# EAGLE schematic Standing Desk Controller Schematic v7 v9 (EAGLE 9.7.0)
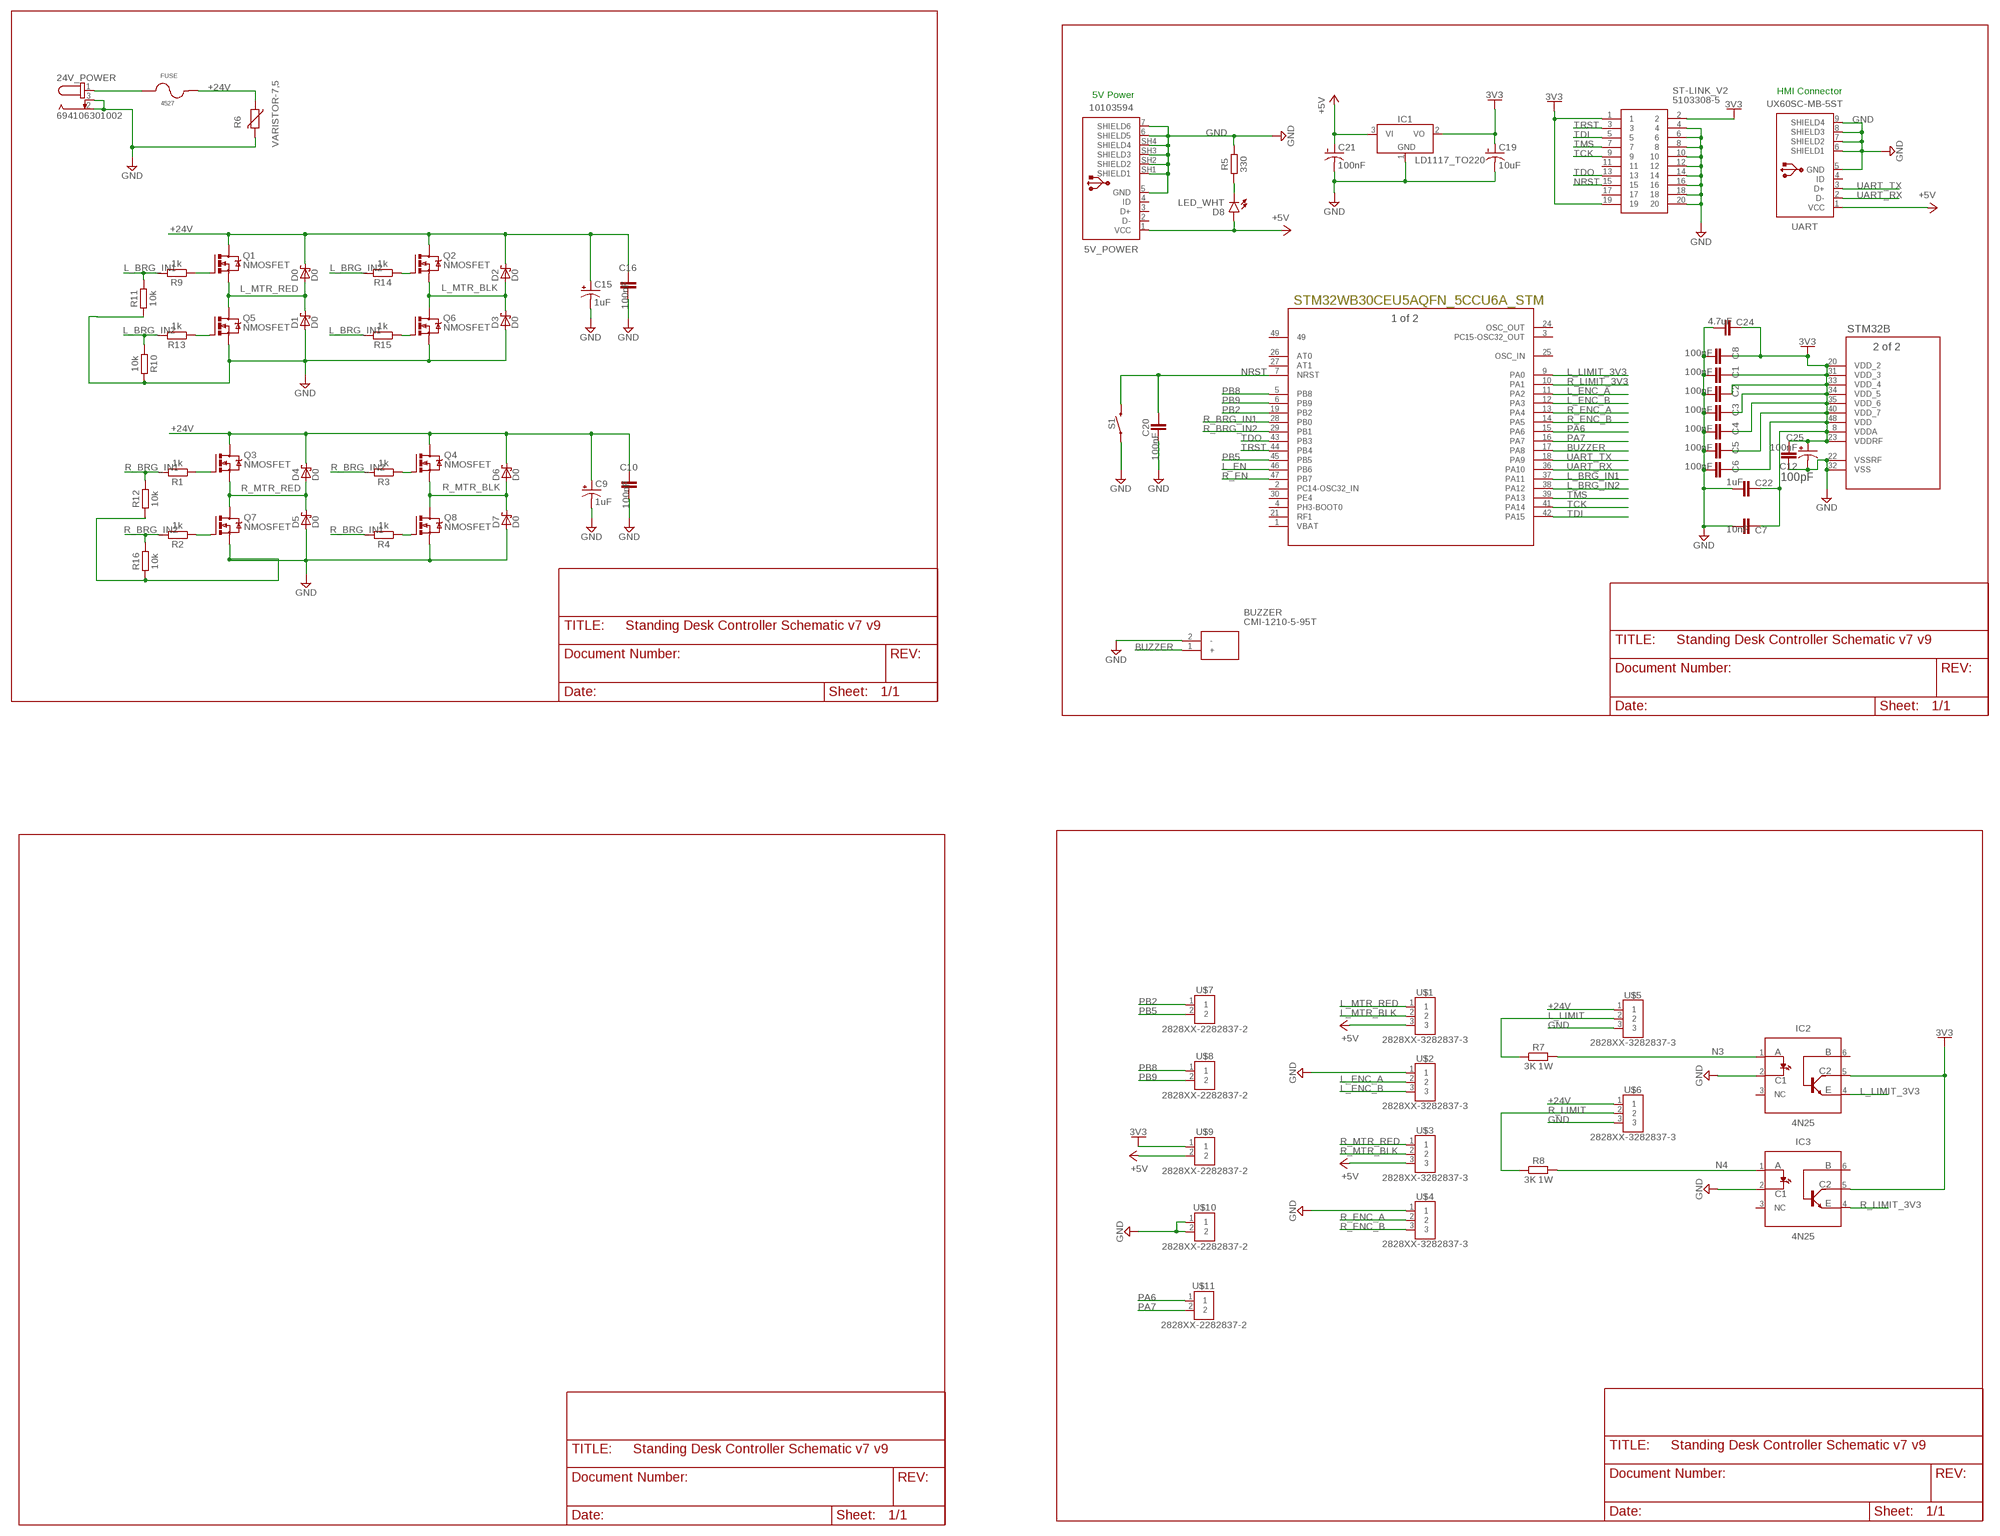
[diagram p0: schematic, sheet 1]

## Parts
5V_POWER  10103594  [10103594]
24V_POWER  694106301002  [694106301002]
BUZZER  CMI-1210-5-95T  [CMI1210595T]
C1  100nF  C_CHIP-1206(3216-METRIC)  [CAPC3216X135]
C2  100nF  C_CHIP-1206(3216-METRIC)  [CAPC3216X135]
C3  100nF  C_CHIP-1206(3216-METRIC)  [CAPC3216X135]
C4  100nF  C_CHIP-1206(3216-METRIC)  [CAPC3216X135]
C5  100nF  C_CHIP-1206(3216-METRIC)  [CAPC3216X135]
C6  100nF  C_CHIP-1206(3216-METRIC)  [CAPC3216X135]
C7  10nF  C_RADIAL-12.5MM-DIA  [CAPRD550W60D1025H1250B]
C8  100nF  C_CHIP-1206(3216-METRIC)  [CAPC3216X135]
C9  1uF  CPOL-USE2.5-6  [E2,5-6]
C10  100nF  C_CHIP-1206(3216-METRIC)  [CAPC3216X135]
C12  100nF  C_CHIP-1206(3216-METRIC)  [CAPC3216X135]
C15  1uF  CPOL-USE2.5-6  [E2,5-6]
C16  100nF  C_CHIP-1206(3216-METRIC)  [CAPC3216X135]
C19  10uF  CPOL-USE2.5-6  [E2,5-6]
C20  100nF  C_CHIP-1206(3216-METRIC)  [CAPC3216X135]
C21  100nF  CPOL-USE2.5-6  [E2,5-6]
C22  1uF  C_RADIAL-12.5MM-DIA  [CAPRD550W60D1025H1250B]
C24  4.7uF  C_RADIAL-12.5MM-DIA  [CAPRD550W60D1025H1250B]
C25  100pF  CPOL-USE2.5-6  [E2,5-6]
D0  D0  SS14CT-ND  [SOD106A-W]
D1  D0  SS14CT-ND  [SOD106A-W]
D2  D0  SS14CT-ND  [SOD106A-W]
D3  D0  SS14CT-ND  [SOD106A-W]
D4  D0  SS14CT-ND  [SOD106A-W]
D5  D0  SS14CT-ND  [SOD106A-W]
D6  D0  SS14CT-ND  [SOD106A-W]
D7  D0  SS14CT-ND  [SOD106A-W]
D8  LED_WHT  CHIP-FLAT-B_1206  [LEDC3216X75N_FLAT-B]
FUSE  4527  [4527]
IC1  LD1117_TO220  [TO220V]
IC2  4N25  [DIP762W60P254L712H480Q6B]
IC3  4N25  [DIP762W60P254L712H480Q6B]
Q1  NMOSFET  NMOSFET_TO220  [TO220BV]
Q2  NMOSFET  NMOSFET_TO220  [TO220BV]
Q3  NMOSFET  NMOSFET_TO220  [TO220BV]
Q4  NMOSFET  NMOSFET_TO220  [TO220BV]
Q5  NMOSFET  NMOSFET_TO220  [TO220BV]
Q6  NMOSFET  NMOSFET_TO220  [TO220BV]
Q7  NMOSFET  NMOSFET_TO220  [TO220BV]
Q8  NMOSFET  NMOSFET_TO220  [TO220BV]
R1  1k  R_CHIP-1206(3216-METRIC)  [RESC3216X70]
R2  1k  R_CHIP-1206(3216-METRIC)  [RESC3216X70]
R3  1k  R_CHIP-1206(3216-METRIC)  [RESC3216X70]
R4  1k  R_CHIP-1206(3216-METRIC)  [RESC3216X70]
R5  330  R_CHIP-1206(3216-METRIC)  [RESC3216X70]
R6  VARISTOR-7,5  [R-7,5]
R7  3K 1W  R_AXIAL-7.2MM-PITCH  [RESAD724W46L381D178B]
R8  3K 1W  R_AXIAL-7.2MM-PITCH  [RESAD724W46L381D178B]
R9  1k  R_CHIP-1206(3216-METRIC)  [RESC3216X70]
R10  10k  R_CHIP-1206(3216-METRIC)  [RESC3216X70]
R11  10k  R_CHIP-1206(3216-METRIC)  [RESC3216X70]
R12  10k  R_CHIP-1206(3216-METRIC)  [RESC3216X70]
R13  1k  R_CHIP-1206(3216-METRIC)  [RESC3216X70]
R14  1k  R_CHIP-1206(3216-METRIC)  [RESC3216X70]
R15  1k  R_CHIP-1206(3216-METRIC)  [RESC3216X70]
R16  10k  R_CHIP-1206(3216-METRIC)  [RESC3216X70]
S1  MOMENTARY-SWITCH-SPST-PTH-6.0MM  [TACTILE_SWITCH_PTH_6.0MM]
ST-LINK_V2  5103308-5  [SHDR20W66P254_2X10_3289X914X98]
STM32  STM32WB30CEU5AQFN_5CCU6A_STM  [QFN_5CCU6A_STM]
U$1  2828XX-3282837-3  [TERMBLK_508-3N]
U$2  2828XX-3282837-3  [TERMBLK_508-3N]
U$3  2828XX-3282837-3  [TERMBLK_508-3N]
U$4  2828XX-3282837-3  [TERMBLK_508-3N]
U$5  2828XX-3282837-3  [TERMBLK_508-3N]
U$6  2828XX-3282837-3  [TERMBLK_508-3N]
U$7  2828XX-2282837-2  [TERMBLK_508-2N]
U$8  2828XX-2282837-2  [TERMBLK_508-2N]
U$9  2828XX-2282837-2  [TERMBLK_508-2N]
U$10  2828XX-2282837-2  [TERMBLK_508-2N]
U$11  2828XX-2282837-2  [TERMBLK_508-2N]
UART  UX60SC-MB-5ST  [UX60SC-MB-5ST]

## Nets
3V3: C1.1 C2.1 C3.1 C4.1 C5.1 C6.1 C7.1 C8.1 C12.1 C19.+ C22.1 C24.1 C25.+ IC1.2(VO) IC2.5(C2) IC3.5(C2) ST-LINK_V2.1 ST-LINK_V2.2 ST-LINK_V2.19 STM32.8(B:VDDA) STM32.20(B:VDD_2) STM32.23(B:VDDRF) STM32.31(B:VDD_3) STM32.33(B:VDD_4) STM32.34(B:VDD_5) STM32.35(B:VDD_6) STM32.40(B:VDD_7) STM32.48(B:VDD) U$9.1
+5V: 5V_POWER.1(VCC) C21.+ D8.A IC1.3(VI) U$1.3 U$3.3 U$9.2 UART.1(VCC)
+24V: C9.+ C10.1 C15.+ C16.1 D0.C D2.C D4.C D6.C FUSE.2 Q1.D Q2.D Q3.D Q4.D R6.1 U$5.1 U$6.1
BUZZER: BUZZER.1(+) STM32.17(A:PA8)
GND: 5V_POWER.5(GND) 5V_POWER.6(SHIELD5) 5V_POWER.7(SHIELD6) 5V_POWER.SH1(SHIELD1) 5V_POWER.SH2(SHIELD2) 5V_POWER.SH3(SHIELD3) 5V_POWER.SH4(SHIELD4) 24V_POWER.2 24V_POWER.3 BUZZER.2(-) C1.2 C2.2 C3.2 C4.2 C5.2 C6.2 C7.2 C8.2 C9.- C10.2 C12.2 C15.- C16.2 C19.- C20.2 C21.- C22.2 C24.2 C25.- D1.A D3.A D5.A D7.A IC1.1(GND) IC2.2(C1) IC3.2(C1) Q5.S Q6.S Q7.S Q8.S R5.2 R6.2 R10.2 R11.1 R12.1 R16.1 S1.1 ST-LINK_V2.4 ST-LINK_V2.6 ST-LINK_V2.8 ST-LINK_V2.10 ST-LINK_V2.12 ST-LINK_V2.14 ST-LINK_V2.16 ST-LINK_V2.18 ST-LINK_V2.20 STM32.22(B:VSSRF) STM32.32(B:VSS) U$2.1 U$4.1 U$5.3 U$6.3 U$10.1 U$10.2 UART.5(GND) UART.6(SHIELD1) UART.7(SHIELD2) UART.8(SHIELD3) UART.9(SHIELD4)
L_BRG_IN1: R9.2 R11.2 R15.2 STM32.37(A:PA11)
L_BRG_IN2: R10.1 R13.2 R14.2 STM32.38(A:PA12)
L_EN: STM32.46(A:PB6)
L_ENC_A: STM32.11(A:PA2) U$2.2
L_ENC_B: STM32.12(A:PA3) U$2.3
L_LIMIT: R7.1 U$5.2
L_LIMIT_3V3: IC2.4(E) STM32.9(A:PA0)
L_MTR_BLK: D2.A D3.C Q2.S Q6.D U$1.2
L_MTR_RED: D0.A D1.C Q1.S Q5.D U$1.1
N3: IC2.1(A) R7.2
N4: IC3.1(A) R8.2
N$1: 24V_POWER.1 FUSE.1
N$2: D8.C R5.1
N$3: Q1.G R9.1
N$4: Q5.G R13.1
N$5: Q3.G R1.1
N$6: Q2.G R14.1
N$7: Q6.G R15.1
N$8: Q7.G R2.1
N$9: Q4.G R3.1
N$10: Q8.G R4.1
NRST: C20.1 S1.3 ST-LINK_V2.15 STM32.7(A:NRST)
PA6: STM32.15(A:PA6) U$11.1
PA7: STM32.16(A:PA7) U$11.2
PB2: STM32.19(A:PB2) U$7.1
PB5: STM32.45(A:PB5) U$7.2
PB8: STM32.5(A:PB8) U$8.1
PB9: STM32.6(A:PB9) U$8.2
R_BRG_IN1: R1.2 R4.2 R12.2 STM32.28(A:PB0)
R_BRG_IN2: R2.2 R3.2 R16.2 STM32.29(A:PB1)
R_EN: STM32.47(A:PB7)
R_ENC_A: STM32.13(A:PA4) U$4.2
R_ENC_B: STM32.14(A:PA5) U$4.3
R_LIMIT: R8.1 U$6.2
R_LIMIT_3V3: IC3.4(E) STM32.10(A:PA1)
R_MTR_BLK: D6.A D7.C Q4.S Q8.D U$3.2
R_MTR_RED: D4.A D5.C Q3.S Q7.D U$3.1
TCK: ST-LINK_V2.9 STM32.41(A:PA14)
TDI: ST-LINK_V2.5 STM32.42(A:PA15)
TDO: ST-LINK_V2.13 STM32.43(A:PB3)
TMS: ST-LINK_V2.7 STM32.39(A:PA13)
TRST: ST-LINK_V2.3 STM32.44(A:PB4)
UART_RX: STM32.36(A:PA10) UART.2(D-)
UART_TX: STM32.18(A:PA9) UART.3(D+)
Unconnected: 5V_POWER.2(D-) 5V_POWER.3(D+) 5V_POWER.4(ID) IC2.3(NC) IC2.6(B) IC3.3(NC) IC3.6(B) ST-LINK_V2.11 ST-LINK_V2.17 STM32.1(A:VBAT) STM32.2(A:PC14-OSC32_IN) STM32.3(A:PC15-OSC32_OUT) STM32.4(A:PH3-BOOT0) STM32.21(A:RF1) STM32.24(A:OSC_OUT) STM32.25(A:OSC_IN) STM32.26(A:AT0) STM32.27(A:AT1) STM32.30(A:PE4) STM32.49 UART.4(ID)

## Notes on the sheet
- HMI Connector
- 5V Power

## Library data of the parts
5V_POWER = Connector_USB:10103594: USB(2.0) Micro-B, RCPT, 5POS, SMD-THT-R/A Datasheet <https://cdn.amphenol-icc.com/media/wysiwyg/files/documentation/datasheet/inputoutput/io_usb_micro.pdf> Drawing <https://cdn.amphenol-icc.com/media/wysiwyg/files/drawing/10103594.pdf>; CATEGORY: Connectors; CONTACTS: 5; CURRENT-RATING: 1.8A; DESCRIPTION: CONN RCPT USB2.0 MICRO B SMD R/A; GENDER: Receptacle; MANUFACTURER: Amphenol ICC (FCI); MOUNT_TYPE: R/A; MPN: 10103594-0001LF; OPERATING_TEMPERATURE: -30°C ~ 80°C; PART_STATUS: ACTIVE; ROHS_COMPLIANT: COMPLIANT; SUB_CATEGORY: USB; TYPE: USB-micro B; VOLTAGE-RATING: 100VAC
24V_POWER = DC Power Jacks:694106301002: CONN PWR JACK 2.1X5.5MM SOLDER Manufacturer's datasheet <https://katalog.we-online.de/em/datasheet/6941xx301002.pdf>; CREATED_BY: PCBLayout.com; DIGIKEY_PART_NUMBER: 732-5930-ND; MANUFACTURER: Wurth Electronics Inc.; MPN: 694106301002
BUZZER = CMI-1210-5-95T:CMI-1210-5-95T: Piezo Buzzers & Audio Indicators 12 mm, 5 Vdc, 98 dB, Through Hole, Magnetic Audio Indicator Buzzer Source: Datasheet <https://www.cuidevices.com/product/resource/cmi-1210-5-95t.pdf>; DESCRIPTION: Piezo Buzzers & Audio Indicators 12 mm, 5 Vdc, 98 dB, Through Hole, Magnetic Audio Indicator Buzzer; HEIGHT: 10mm; MANUFACTURER_NAME: CUI Inc.; MANUFACTURER_PART_NUMBER: CMI-1210-5-95T; MOUSER_PART_NUMBER: 179-CMI-1210-5-95T; MOUSER_PRICE-STOCK: https://www.mouser.co.uk/ProductDetail/CUI-Devices/CMI-1210-5-95T?qs=Rp5uXu7WBW9WJf9tZv97Vg%3D%3D
C1-C6 C8 C12 = Capacitor_Bottom_Side:C: Capacitor - Generic; CATEGORY: Capacitor
C7 C10 C16 C20 C22 C24 = Capacitor:C: Capacitor - Generic; CATEGORY: Capacitor
C9 C15 C19 C21 C25 = rcl:CPOL-US: POLARIZED CAPACITOR, American symbol; SPICEPREFIX: C
D0 D1-D7 = L298_Motor_Driver_Lib_ECE5780:SS14CT-ND: Schottky Diode: SS14CT-ND, 40V, 1A, DO-214AC, SMA
D8 = LED:CHIP-FLAT-B; CATEGORY: LED; COLOR: BLUE; DESCRIPTION: CHIP LED FLAT; SUB-CATEGORY: CHIP; TYPE: FLAT_TOP; VALUE: LED_BLUE
FUSE = Fuse Holder:4527: FUSE HLDR CARTRIDGE 250V 5A PCB Manufacturer's datasheet <https://www.keyelco.com/userAssets/file/M65p44.pdf>; CREATED_BY: PCBLayout.com; DIGIKEY_PN: 36-4527-ND; MANUFACTURER: Keystone Electronics; MPN: 4527
IC1 = IC_Power-Management:LD1117: Adjustable and fixed positive voltage regulator Reference Datasheet <https://www.st.com/content/ccc/resource/technical/document/datasheet/99/3b/7d/91/91/51/4b/be/CD00000544.pdf/files/CD00000544.pdf/jcr:content/translations/en.CD00000544.pdf>; CATEGORY: IC_Linear; DESCRIPTION: Adjustable voltage regulator; MANUFACTURER: STMicroelectronics; MPN: Generic; SERIES: LM1117; SUB-CATEGORY: Voltage Regulator; TYPE: Linear
IC2 IC3 = Opto-Electronic:4N: Optocoupler, Phototransistor Output, with Base Connection Datasheet <https://www.vishay.com/docs/83725/4n25.pdf>; CATEGORY: Opto-Electronic; DESCRIPTION: Optoisolator Transistor with Base Output 5000Vrms Channel 6-DIP; MANUFACTURER: Vishay; MPN: 4N25; OPERATING_TEMP: - 55°C to + 100 °C; PART_STATUS: Active; ROHS_COMPLIANT: COMPLIANT; SERIES: 4N2x; SUB-CATEGORY: Optocoupler; THERMALLOSS: 0.150 W
Q1-Q8 = Transistor:NMOSFET: N-Channel MOSFET - Generic; CATEGORY: Transistor; SUB-CATEGORY: MOSFET; TYPE: N-Channel
R1-R5 R7-R16 = Resistor:R: Resistor Fixed - Generic; CATEGORY: Resistor; SUB-CATEGORY: Fixed
R6 = varistor:VARISTOR: VARISTOR
S1 = SparkFun-Switches:MOMENTARY-SWITCH-SPST: Momentary Switch (Pushbutton) - SPST Normally-open (NO) SPST momentary switches (buttons, pushbuttons). Variants PTH-12MM - 12mm square, through-hole Momentary Pushbutton Switch - 12mm Square <https://www.sparkfun.com/products/9190> (COM-09190) PTH-6.0MM, PTH-6.0MM-KIT - 6.0mm square, through-hole Mini Pushbutton Switch <https://www.sparkfun.com/products/97> (COM-00097) KIT package intended for soldering kit's - only one side of pads' copper is exposed. PTH-RIGHT-ANGLE-KIT - Right-angle, through-hole Right Angle Tactile Button <https://www.sparkfun.com/products/10791> - Used on SparkFun BigTime Watch Kit <https://www.sparkfun.com/products/11734> SMD-12MM - 12mm square, surface-mount Tactile Button - SMD (12mm) <https://www.sparkfun.com/products/12993> (COM-12993) Used on SparkFun PicoBoard <https://www.sparkfun.com/products/11888> SMD-4.5MM - 4.5mm Square Trackball Switch Used on SparkFun Blackberry Trackballer Breakout <https://www.sparkfun.com/products/13169> SMD-4.6MMX2.8MM - 4.60mm x 2.80mm, surface mount Used on SparkFun SAMD21 Mini Breakout <https://www.sparkfun.com/products/13664> SMD-5.2MM, SMD-5.2-REDUNDANT - 5.2mm square, surface-mount Mini Pushbutton Switch - SMD <https://www.sparkfun.com/products/8720> (COM-08720) Used on Arduino Pro Mini <https://www.sparkfun.com/products/11114> REDUNDANT package connects both switch circuits together SMD-6.0X3.5MM - 6.0 x 3.5mm, surface mount Momentary Reset Switch SMD <https://www.sparkfun.com/products/8229> (COM-08229) SMD-6.2MM-TALL - 6.2mm square, surface mount Tactile Button - SMD (6mm) <https://www.sparkfun.com/products/12992> Used on SparkFun Digital Sandbox <https://www.sparkfun.com/products/12651> SMD-RIGHT-ANGLE - Right-angle, surface mount Used on SparkFun Block for Intel® Edison - Arduino <https://www.sparkfun.com/products/13036>; PROD_ID: SWCH-08441; SF_SKU: COM-00097
ST-LINK_V2 = 5103308-5:5103308-5: 20 Way HE10 Str PCB Header Plug TE Connectivity AMP-LATCH Series, 2.54mm Pitch 20 Way 2 Row Shrouded Straight PCB Header, Through Hole Source: Datasheet <https://componentsearchengine.com/Datasheets/1/5103308-5.pdf>; DESCRIPTION: 20 Way HE10 Str PCB Header Plug TE Connectivity AMP-LATCH Series, 2.54mm Pitch 20 Way 2 Row Shrouded Straight PCB Header, Through Hole; HEIGHT: 9.855mm; MANUFACTURER_NAME: TE Connectivity; MANUFACTURER_PART_NUMBER: 5103308-5; MOUSER_PART_NUMBER: 571-5103308-5; MOUSER_PRICE-STOCK: https://www.mouser.co.uk/ProductDetail/TE-Connectivity/5103308-5?qs=84A%2FDAdkstIALbbUeUfP1g%3D%3D
STM32 = STM32WB30CE_Fixed:STM32WB30CEU5A; COPYRIGHT: Copyright (C) 2022 Ultra Librarian. All rights reserved.; MANUFACTURER_PART_NUMBER: STM32WB30CEU5A; MFR_NAME: STMicroelectronics
U$1-U$6 = Connector:2828XX-3: 3 Position Wire to Board Terminal Block Horizontal with Board Datasheet <https://www.te.com.cn/commerce/DocumentDelivery/DDEController?Action=showdoc&DocId=Catalog+Section%7F1308389_EUROSTYLE_TERMINAL_BLOCKS%7F0607%7Fpdf%7FEnglish%7FENG_CS_1308389_EUROSTYLE_TERMINAL_BLOCKS_0607.pdf%7F2-282837-5>; CATEGORY: Connector; DESCRIPTION: TERM BLK 3P SIDE ENT 5.08mm PCB; MANUFACTURER: TE Connectivity; MPN: 282837-3; OPERATING_TEMPERATURE: -40°C to +105°C; PART_STATUS: Active; ROHS_COMPLIANCE: RoHS Compliant; SERIES: 282837; SUBCATEGORY: Terminal Block; TYPE: Side Wire Entry
U$7-U$11 = Connector:2828XX-2: 2 Position Wire to Board Terminal Block Horizontal with Board Datasheet <https://www.te.com.cn/commerce/DocumentDelivery/DDEController?Action=showdoc&DocId=Catalog+Section%7F1308389_EUROSTYLE_TERMINAL_BLOCKS%7F0607%7Fpdf%7FEnglish%7FENG_CS_1308389_EUROSTYLE_TERMINAL_BLOCKS_0607.pdf%7F2-282837-5>; CATEGORY: Connector; DESCRIPTION: 2 Position Wire to Board Terminal Block Horizontal with Board 5.08 mm Through Hole; MANUFACTURER: TE Connectivity; MPN: 282837-2; OPERATING_TEMPERATURE: -40°C to +105°C; PART_STATUS: ACTIVE; ROHS_COMPLIANCE: RoHS Compliant; SERIES: 282837; SUBCATEGORY: Terminal Block; TYPE: Side Wire Entry
UART = Connector_USB:UX60SC-MB-5ST: USB(2.0) Mini-B, RCPT, 5POS, SMD-R/A Datasheet <https://www.hirose.com/product/document?clcode=CL0240-0016-6-80&productname=UX60SC-MB-5ST(80)&series=UX&documenttype=Catalog&lang=en&documentid=D31610_en> Drawing <https://www.hirose.com/product/document?clcode=CL0240-0016-6-80&productname=UX60SC-MB-5ST(80)&series=UX&documenttype=2DDrawing&lang=en&documentid=0000903446>; CATEGORY: Connector; CONTACTS: 4; CURRENT_RATING: 1A; DESCRIPTION: CONN RCPT USB2.0 MINI B SMD R/A; GENDER: Receptacle; MANUFACTURER: Hirose Electric Co. Ltd; MOUNT_TYPE: R/A; MPN: UX60SC-MB-5ST(80); OPERATING_TEMP: -30°C to 75°C; PART_STATUS: Active; ROHS_COMPLIANT: RoHS Compliant; SERIES: UX; SUB-CATEGORY: USB; TYPE: USB-Mini B; VOLTAGE_RATING: 30V AC